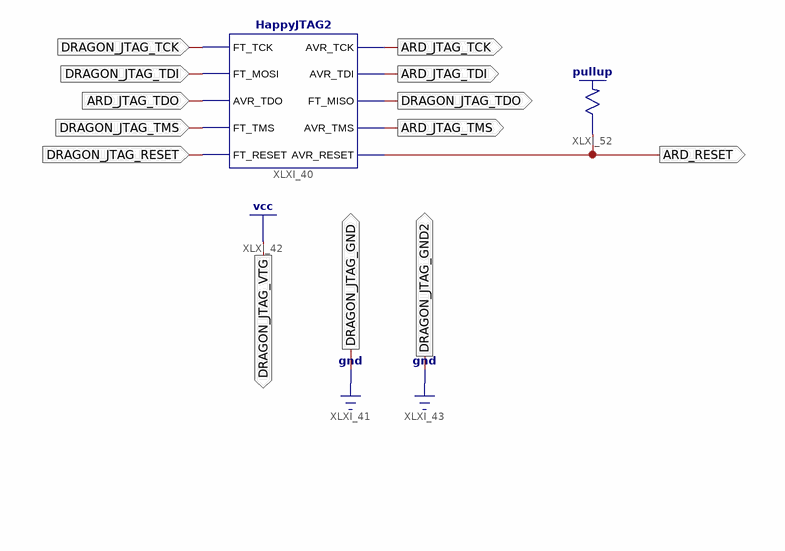
[diagram p0: schematic sheet 1]
// Xilinx ISE schematic Papilio_Pro.sch (spartan6) as structural Verilog: 2 symbols, 13 ports
module Papilio_Pro (
  input  DRAGON_JTAG_TCK,
  input  DRAGON_JTAG_TDI,
  input  DRAGON_JTAG_TMS,
  input  ARD_JTAG_TDO,
  input  DRAGON_JTAG_RESET,
  output DRAGON_JTAG_TDO,
  output ARD_JTAG_TCK,
  output ARD_JTAG_TMS,
  output ARD_JTAG_TDI,
  output DRAGON_JTAG_GND,
  output DRAGON_JTAG_GND2,
  output DRAGON_JTAG_VTG,
  output ARD_RESET
);

  HappyJTAG2 XLXI_40 (
    .FT_TCK(DRAGON_JTAG_TCK), .FT_MOSI(DRAGON_JTAG_TDI), .FT_MISO(DRAGON_JTAG_TDO), .FT_TMS(DRAGON_JTAG_TMS),
    .FT_RESET(DRAGON_JTAG_RESET), .AVR_TCK(ARD_JTAG_TCK), .AVR_TDI(ARD_JTAG_TDI), .AVR_TDO(ARD_JTAG_TDO),
    .AVR_TMS(ARD_JTAG_TMS), .AVR_RESET(ARD_RESET));
  \pullup  XLXI_52 (.O(ARD_RESET));

  assign DRAGON_JTAG_GND = 1'b0;
  assign DRAGON_JTAG_GND2 = 1'b0;
  assign DRAGON_JTAG_VTG = 1'b1;
endmodule
